# Altium schematic sheet llll.SchDoc
size A4
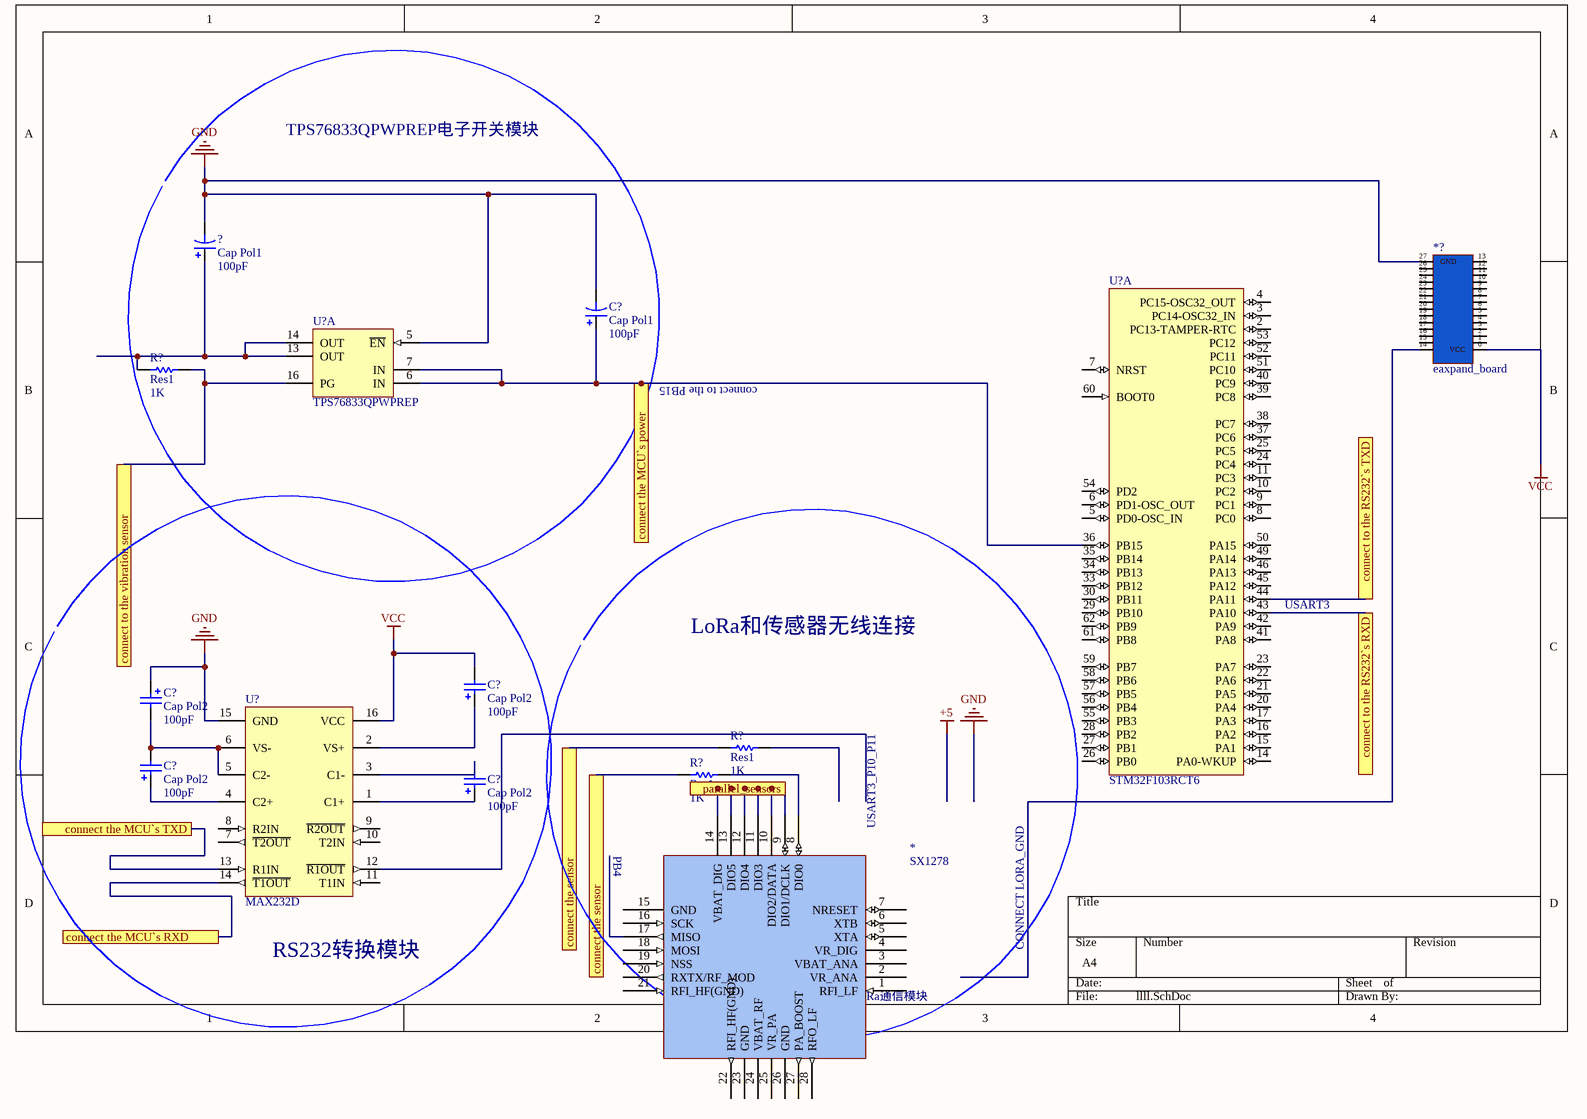
[diagram p0: llll.SchDoc]

## Parts
(Parts that share a designator on the sheet are numbered #1, #2 ... from top to bottom, then left to right.)
*  SX1278
*?  eaxpand_board  [expand_board]
?  Cap Pol1  value 100pF  [RB7.6-15]
C?#1  Cap Pol1  value 100pF  [RB7.6-15]
C?#2  Cap Pol2  value 100pF  [POLAR0.8]
C?#3  Cap Pol2  value 100pF  [POLAR0.8]
C?#4  Cap Pol2  value 100pF  [POLAR0.8]
C?#5  Cap Pol2  value 100pF  [POLAR0.8]
R?#1  Res1  value 1K  [AXIAL-0.3]
R?#2  Res1  value 1K  [AXIAL-0.3]
R?#3  Res1  value 1K  [AXIAL-0.3]
U?#1  TPS76833QPWPREP  [TI-PWP20-2980X2000TP_N]  (part A of 3)
U?#2  STM32F103RCT6  [STM-LQFP64_N]  (part A of 2)
U?#3  MAX232D  [TI-D16_N]

## Ports
connect the MCU`s power, connect the MCU`s RXD, connect the MCU`s TXD, connect the sensor, connect to the RS232`s RXD, connect to the RS232`s TXD, connect to the vibration sensor, parallel_sensors

## Nets
GND: *?.27(GND) ?.2 C?#1.2 C?#2.1 U?#1.5(~{EN}) U?#3.15(GND)
VCC: *?.0(VCC) C?#3.2 U?#3.16(VCC)
connect the MCU`s power: C?#1.1 U?#1.6(IN) U?#1.7(IN) U?#2.36(PB15) ; port connect the MCU`s power
connect the MCU`s RXD: U?#3.14(~{T1OUT}) ; port connect the MCU`s RXD
connect the MCU`s TXD: U?#3.13(R1IN) ; port connect the MCU`s TXD
connect the sensor: R?#2.1 R?#3.1 ; port connect the sensor
connect to the RS232`s RXD: U?#2.43(PA10) ; port connect to the RS232`s RXD
connect to the RS232`s TXD: U?#2.44(PA11) ; port connect to the RS232`s TXD
connect to the vibration sensor: R?#1.2 U?#1.16(PG) ; port connect to the vibration sensor
parallel_sensors: *.9(DIO1/DCLK) ; port parallel_sensors
Net*_8: *.8(DIO0) R?#3.2
Net?_1: ?.1 R?#1.1 U?#1.13(OUT) U?#1.14(OUT)
NetC?#2_2: C?#2.2 C?#4.2 U?#3.5(C2-) U?#3.6(VS-)
NetC?#3_1: C?#3.1 U?#3.2(VS+)
NetC?#4_1: C?#4.1 U?#3.4(C2+)
NetC?#5_1: C?#5.1 U?#3.1(C1+)
NetC?#5_2: C?#5.2 U?#3.3(C1-)

Not connected (* = marked no-connect by the designer): * 1(RFI_LF) 2(VR_ANA) 3(VBAT_ANA) 4(VR_DIG) 5(XTA) 6(XTB) 7(NRESET) 10(DIO2/DATA) 11(DIO3) 12(DIO4) 13(DIO5) 14(VBAT_DIG) 15(GND) 16(SCK) 17(MISO) 18(MOSI) 19(NSS) 20(RXTX/RF_MOD) 21(RFI_HF(GND)) 22(RFI_HF(GND)) 23(GND) 24(VBAT_RF) 25(VR_PA) 26(GND) 27(PA_BOOST) 28(RFO_LF); *? 1 2 3 4 5(\) 6 7 8 9 10 11 12 13 14 15 16 17 18 19 20 21 22 23 24 25 26; R?#2 2; U?#2 2(PC13-TAMPER-RTC) 3(PC14-OSC32_IN) 4(PC15-OSC32_OUT) 5(PD0-OSC_IN) 6(PD1-OSC_OUT) 7(NRST) 8(PC0) 9(PC1) 10(PC2) 11(PC3) 14(PA0-WKUP) 15(PA1) 16(PA2) 17(PA3) 20(PA4) 21(PA5) 22(PA6) 23(PA7) 24(PC4) 25(PC5) 26(PB0) 27(PB1) 28(PB2) 29(PB10) 30(PB11) 33(PB12) 34(PB13) 35(PB14) 37(PC6) 38(PC7) 39(PC8) 40(PC9) 41(PA8) 42(PA9) 45(PA12) 46(PA13) 49(PA14) 50(PA15) 51(PC10) 52(PC11) 53(PC12) 54(PD2) 55(PB3) 56(PB4) 57(PB5) 58(PB6) 59(PB7) 60(BOOT0) 61(PB8) 62(PB9); U?#3 7(~{T2OUT}) 8(R2IN) 9(~{R2OUT}) 10(T2IN) 11(T1IN) 12(~{R1OUT})

## Notes on the sheet
- TPS76833QPWPREP电子开关模块
- connect to the PB15
- LoRa和传感器无线连接
- (near U?#2) USART3
- (near *) PB4
- (near *) USART3_P10_P11
- RS232转换模块
- CONNECT LORA_GND
- (near *) LoRa通信模块

## Library data of the parts
* = SX1278: LORA
? C?#1 = Cap Pol1: Polarized Capacitor (Radial); Published: 8-Jun-2000; LatestRevisionDate: 17-Jul-2002; LatestRevisionNote: Re-released for DXP Platform.; PackageReference: RB7.6-15; Publisher: Altium Limited; PackageDescription: Polarized Capacitor (Radial); 2 Leads
C?#2-C?#5 = Cap Pol2: Polarized Capacitor (Axial); Published: 8-Jun-2000; LatestRevisionDate: 17-Jul-2002; LatestRevisionNote: Re-released for DXP Platform.; PackageReference: POLAR0.8; Publisher: Altium Limited; PackageDescription: Polarized Capacitor; 2 Leads
R?#1-R?#3 = Res1: Resistor; Published: 8-Jun-2000; LatestRevisionDate: 17-Jul-2002; LatestRevisionNote: Re-released for DXP Platform.; PackageReference: AXIAL-0.3; Publisher: Altium Limited; PackageDescription: Axial Device, Thru-Hole; 2 Leads; 0.3 in Pin Spacing
U?#1 = TPS76833QPWPREP: Single Output Fast Transient Response LDO, 1 A, Fixed 3.3 V Output, 2.7 to 10 V Input, 20-pin HTSSOP (PWP), -40 to 125 degC, Green (RoHS & no Sb/Br); Manufacturer: Texas Instruments; Accuracy(%): 2; Fixed Output Options(V): 3.3; Iout(Max)(A): 1; Iq(Typ)(mA): 0.08; Power Good: TRUE; SubFamily: Single Channel LDO; Vdo(Typ)(mV): 350; Vin(Max)(V): 10; Vin(Min)(V): 2.7; DatasheetVersion: SGLS011B; PackageVersion: 4073225-4/I; PackageReference: PWP20-2980X2000TP; PackageDescription: 20-Pin Plastic Small Outline, Body 4.4 x 6.5 mm, Pitch 0.65 mm; Supplier 1: Digi-Key; Supplier Part Number 1: 296-21901-2-ND; Supplier 2: Digi-Key; Supplier Part Number 2: 296-21901-1-ND; Supplier 3: Digi-Key; Supplier Part Number 3: 296-21901-6-ND; Supplier 4: Newark; Supplier Part Number 4: 46M1185; Supplier 5: Mouser; Supplier Part Number 5: 595-TPS76833QPWPREP; Eco-Plan: Green (RoHS & no Sb/Br); Vout Adj(Max)(V): 3.3; Vout Adj(Min)(V): 3.3; Mounting Technology: Surface Mount; Code_JEDEC: MO-153; PartNumber: TPS76833QPWPREP; ComponentLink1Description: Manufacturer URL; ComponentLink1URL: http://www.ti.com/; ComponentLink2Description: Datasheet; ComponentLink2URL: http://www.ti.com/general/docs/lit/getliterature.tsp?genericPartNumber=TPS76833-EP&fileType=pdf; ComponentLink3Description: Package Specification; ComponentLink3URL: http://www.ti.com/litv/pdf/mhts001g
U?#2 = STM32F103RCT6: ARM Cortex-M3 32-bit MCU, 256 KB Flash, 48 KB Internal RAM, 51 I/Os, 64-pin LQFP, -40 to 85 degC, Tray; A/D Converter: 3x12-bit (16 Channel); D/A Converter: 2x12-bit (2 Channel); FLASH Size (Prog) (kB): 256; I/Os (High Current): 51; Internal RAM Size (kB): 48; Operating Frequency(F) (Processor speed) (MHz): 72; Supply Voltage(Vcc) min (V): 2; DatasheetVersion: Rev. 8; PackageVersion: Rev. 4, 06/2013; PackageReference: LQFP64; PackageDescription: 64-Pin Low Profile Quad Flat Package, 10 x 10 mm Body, 0.5 mm Pitch; Supplier 1: Digi-Key; Supplier Part Number 1: 497-9033-ND; Supplier 2: Newark; Supplier Part Number 2: 01P4099; Supplier 3: Newark; Supplier Part Number 3: 57P1227; Supplier 4: Mouser; Supplier Part Number 4: 511-STM32F103RCT6; Core: ARM Cortex-M3; Packing: Tray; Mounting Technology: Surface Mount; PartNumber: STM32F103RCT6; ComponentLink1Description: Manufacturer URL; ComponentLink1URL: http://www.st.com/web/en/home.html; ComponentLink2Description: Datasheet; ComponentLink2URL: http://www.st.com/st-web-ui/static/active/en/resource/technical/document/datasheet/CD00191185.pdf; ComponentLink3Description: Package Specification; ComponentLink3URL: http://www.st.com/st-web-ui/static/active/en/resource/technical/document/datasheet/DM00037051.pdf
U?#3 = MAX232D: Dual EIA-232 Driver / Receiver, 0 to 70 degC, 16-Pin SOIC (D), Green (RoHS & no Sb/Br); SubFamily: RS-232; Drivers Per Package: 2; Supply Voltage(s)(V): 5; ESD HBM(kV): +/-2; ICC(Max)(mA): 10; Single Supply: TRUE; DatasheetVersion: SLLS047L; PackageVersion: revM, Jun-2011; PackageReference: D16; PackageDescription: 16-Pin Plastic Small Outline Integrated Circuit, 9.9 x 3.9 mm, Pitch 1.27 mm Pitch; Receivers Per Package: 2; RS-232: TRUE; ComponentLink1Description: Manufacturer URL; ComponentLink1URL: www.ti.com; ComponentLink2Description: Datasheet; ComponentLink2URL: http://www.ti.com/general/docs/lit/getliterature.tsp?genericPartNumber=MAX232&fileType=pdf; ComponentLink3Description: Package Specification; ComponentLink3URL: http://www.ti.com/litv/pdf/mpds178g